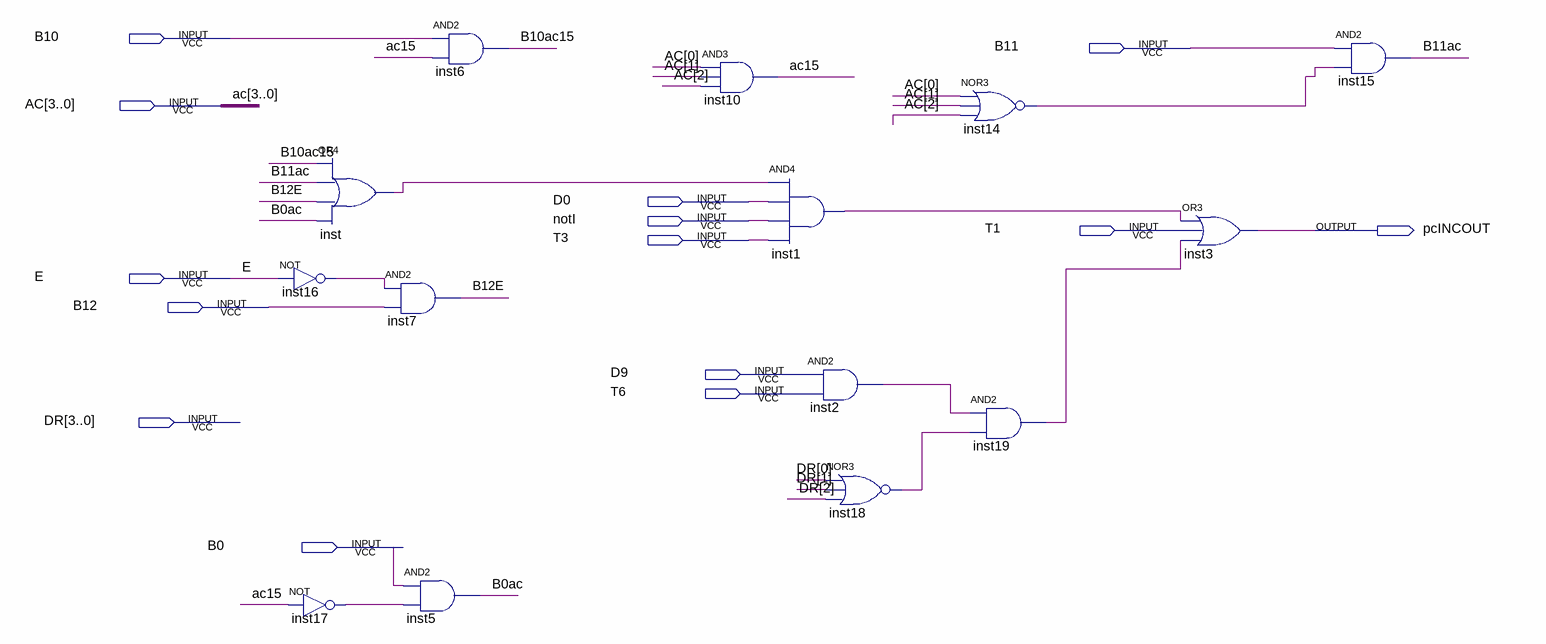
[diagram p0: schematic sheet]
// Quartus schematic pcINC.bdf as structural Verilog: 14 symbols, 14 pins
module pcINC (
  input  B10,
  input  B11,
  input  [3:0] AC,
  input  D0,
  input  notI,
  input  T1,
  input  T3,
  input  E,
  input  B12,
  input  D9,
  input  T6,
  input  [3:0] DR,
  input  B0,
  output pcINCOUT
);

  wire ac15, B0ac, B10ac15, B11ac, B12E, inst1_out, inst2_out, inst14_out, inst16_out, inst17_out,
       inst18_out, inst19_out, inst_out;

  not inst16 (inst16_out, E);
  not inst17 (inst17_out, ac15);
  or inst (inst_out, B10ac15, B11ac, B12E, B0ac);
  and inst7 (B12E, inst16_out, B12);
  and inst6 (B10ac15, B10, ac15);
  and inst5 (B0ac, B0, inst17_out);
  and inst10 (ac15, AC[0], AC[1], AC[2]);
  and inst1 (inst1_out, inst_out, D0, notI, T3);
  and inst2 (inst2_out, D9, T6);
  nor inst18 (inst18_out, DR[0], DR[1], DR[2]);
  nor inst14 (inst14_out, AC[0], AC[1], AC[2]);
  and inst19 (inst19_out, inst2_out, inst18_out);
  or inst3 (pcINCOUT, inst1_out, T1, inst19_out);
  and inst15 (B11ac, B11, inst14_out);
endmodule
